# Altium schematic sheet ESP.SchDoc
size A3
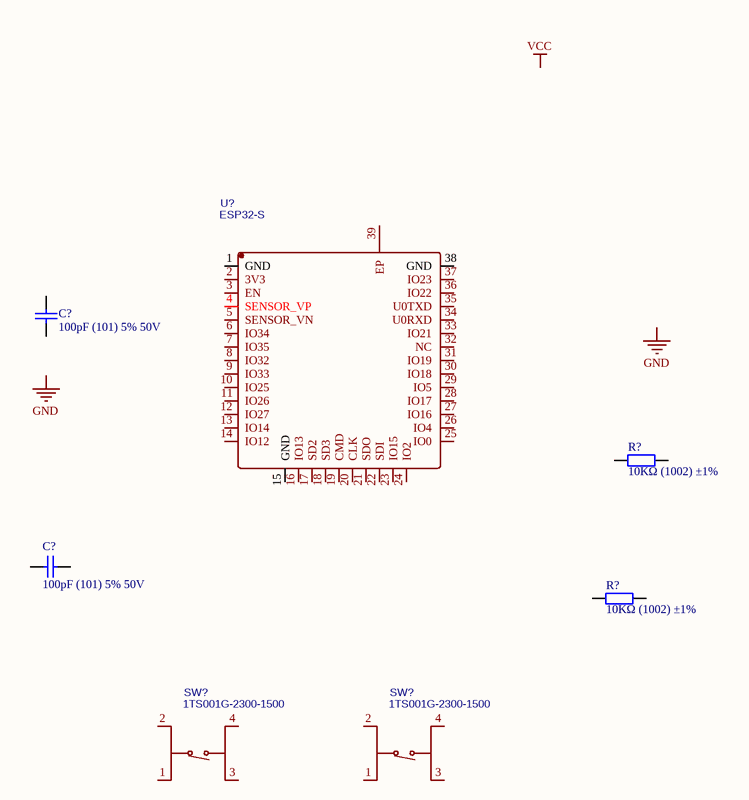
[diagram p0: ESP.SchDoc]

## Parts
(Parts that share a designator on the sheet are numbered #1, #2 ... from top to bottom, then left to right.)
C?#1  100pF (101) 5% 50V  [0603_C]
C?#2  100pF (101) 5% 50V  [0603_C]
R?#1  10KΩ (1002) ±1%  [0603_R]
R?#2  10KΩ (1002) ±1%  [0603_R]
SW?#1  1TS001G-2300-1500  [button]
SW?#2  1TS001G-2300-1500  [button]
U?  ESP32-S  [ESP32-S]

## Nets

Not connected (* = marked no-connect by the designer): C?#1 1 2; C?#2 1 2; R?#1 1 2; R?#2 1 2; SW?#1 1(A) 2(B) 3(C) 4(D); SW?#2 1(A) 2(B) 3(C) 4(D); U? 1(GND) 2(3V3) 3(EN) 4(SENSOR_VP) 5(SENSOR_VN) 6(IO34) 7(IO35) 8(IO32) 9(IO33) 10(IO25) 11(IO26) 12(IO27) 13(IO14) 14(IO12) 15(GND) 16(IO13) 17(SD2) 18(SD3) 19(CMD) 20(CLK) 21(SDO) 22(SDI) 23(IO15) 24(IO2) 25(IO0) 26(IO4) 27(IO16) 28(IO17) 29(IO5) 30(IO18) 31(IO19) 32(NC) 33(IO21) 34(U0RXD) 35(U0TXD) 36(IO22) 37(IO23) 38(GND) 39(EP)

## Notes on the sheet
- Labels drawn without touching a wire or pin: GND, VCC

## Library data of the parts
C?#1 C?#2 = 0603 100pF (101) 5% 50V: 贴片电容; ComponentLink1Description: 供应商链接; ComponentLink1URL: http://www.szlcsc.com/product/details_15530.html; Package: 0603; Supplier: LC; SuppliersPartNumber: C14858
R?#1 R?#2 = 0603 10KΩ (1002) 1%: 贴片电阻; ComponentLink1Description: 供应商链接; ComponentLink1URL: http://www.szlcsc.com/product/details_26547.html; Package: 0603; Supplier: LC; SuppliersPartNumber: C25804
SW?#1 SW?#2 = 1TS001G-2300-1500: BOM_Manufacturer: HYP; Contributor: LCSC; BOM_Supplier: LCSC; BOM_Supplier Part: C318796; BOM_Manufacturer Part: 1TS001G-2300-1500; spicePre: S; spiceSymbolName: 1TS001G-2300-1500
U? = ESP32-S: BOM_Manufacturer: Ai-Thinker; Contributor: LCSC; SMT Type: Extend; BOM_Supplier: LCSC; BOM_Supplier Part: C277944; BOM_Manufacturer Part: ESP32-S; BOM_JLCPCB SMD: Yes; spicePre: U; spiceSymbolName: ESP32-S